# Altium schematic sheet AC_POWER_Block.SchDoc
size A4; CheckedBy: CT-Energys; Author: CT-Energys; CompanyName: HTD COMPANY LIMITED; DrawnBy: CHITOAN; Engineer: CHITOAN; Organization: Altium Limited; Address1: HO CHI MINH CITY; Address2: VIETNAM
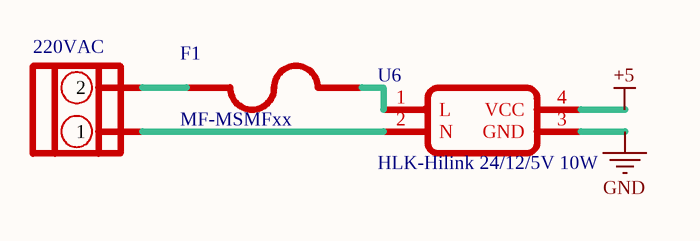
[diagram p0: AC_POWER_Block.SchDoc]

## Parts
F1  MF-MSMFxx  [Fuse-1808]
H2  220VAC  [KF301-2-V]
U6  HLK-Hilink 24/12/5V 10W  [HLK-HiLink AC-DC 10W]

## Nets
+5: U6.4(VCC)
GND: U6.3(GND)
NetF1_1: F1.1 H2.2
NetF1_2: F1.2 U6.1(L)
NetH2_1: H2.1 U6.2(N)

## Notes on the sheet
- Title
- Size:
- Date:
- A4
- Number:
- Time:
- Revision:
- Design by:
- Company:
- File:

## Library data of the parts
F1 = Fuse: MF-MSMF Series - PTC Resettable Fuses; ComponentLink1Description: MF-MSMF Series; ComponentLink1URL: https://www.bourns.com/docs/product-datasheets/mf-msmf.pdf
H2 = KF301-2-V: Connector 5.08MM Pitch Vertical 2 Pole
U6 = HLK-Hilink 24/12/5V 10W: Module AC to DC 220AC-24/12/5VDC 10W